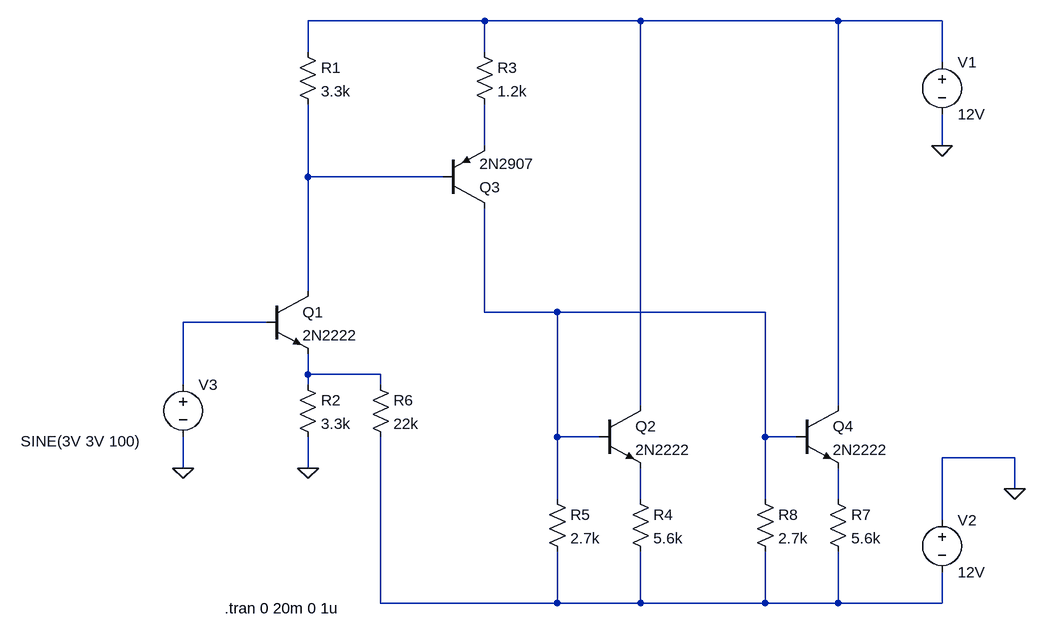
[diagram p0: schematic current_control.asc]
current_control.asc, the LTspice schematic file:
Version 4
SHEET 1 1156 680
WIRE 320 -256 48 -256
WIRE 560 -256 320 -256
WIRE 864 -256 560 -256
WIRE 1024 -256 864 -256
WIRE 48 -208 48 -256
WIRE 320 -208 320 -256
WIRE 1024 -192 1024 -256
WIRE 320 -64 320 -128
WIRE 1024 -64 1024 -112
WIRE 48 -16 48 -128
WIRE 256 -16 48 -16
WIRE 48 160 48 -16
WIRE 320 192 320 32
WIRE 432 192 320 192
WIRE 752 192 432 192
WIRE -16 208 -144 208
WIRE 48 288 48 256
WIRE 160 288 48 288
WIRE -144 304 -144 208
WIRE 48 304 48 288
WIRE 160 304 160 288
WIRE 560 336 560 -256
WIRE 864 336 864 -256
WIRE 432 384 432 192
WIRE 496 384 432 384
WIRE 752 384 752 192
WIRE 800 384 752 384
WIRE 1136 416 1024 416
WIRE -144 432 -144 384
WIRE 48 432 48 384
WIRE 1136 464 1136 416
WIRE 432 480 432 384
WIRE 560 480 560 432
WIRE 752 480 752 384
WIRE 864 480 864 432
WIRE 1024 512 1024 416
WIRE 160 640 160 384
WIRE 432 640 432 560
WIRE 432 640 160 640
WIRE 560 640 560 560
WIRE 560 640 432 640
WIRE 752 640 752 560
WIRE 752 640 560 640
WIRE 864 640 864 560
WIRE 864 640 752 640
WIRE 1024 640 1024 592
WIRE 1024 640 864 640
FLAG 1024 -64 0
FLAG 48 432 0
FLAG 1136 464 0
FLAG -144 432 0
SYMBOL npn2 -16 160 R0
SYMATTR InstName Q1
SYMATTR Value 2N2222
SYMBOL npn2 496 336 R0
SYMATTR InstName Q2
SYMATTR Value 2N2222
SYMBOL pnp2 256 32 M180
SYMATTR InstName Q3
SYMATTR Value 2N2907
SYMBOL voltage 1024 -208 R0
WINDOW 123 0 0 Left 0
WINDOW 39 0 0 Left 0
SYMATTR InstName V1
SYMATTR Value 12V
SYMBOL res 32 288 R0
SYMATTR InstName R2
SYMATTR Value 3.3k
SYMBOL res 304 -224 R0
SYMATTR InstName R3
SYMATTR Value 1.2k
SYMBOL voltage 1024 496 R0
WINDOW 123 0 0 Left 0
WINDOW 39 0 0 Left 0
SYMATTR InstName V2
SYMATTR Value 12V
SYMBOL res 544 464 R0
SYMATTR InstName R4
SYMATTR Value 5.6k
SYMBOL res 416 464 R0
SYMATTR InstName R5
SYMATTR Value 2.7k
SYMBOL voltage -144 288 R0
WINDOW 123 0 0 Left 0
WINDOW 39 0 0 Left 0
WINDOW 3 -250 103 Left 2
SYMATTR Value SINE(3V 3V 100)
SYMATTR InstName V3
SYMBOL res 32 -224 R0
SYMATTR InstName R1
SYMATTR Value 3.3k
SYMBOL res 144 288 R0
SYMATTR InstName R6
SYMATTR Value 22k
SYMBOL npn2 800 336 R0
SYMATTR InstName Q4
SYMATTR Value 2N2222
SYMBOL res 848 464 R0
SYMATTR InstName R7
SYMATTR Value 5.6k
SYMBOL res 736 464 R0
SYMATTR InstName R8
SYMATTR Value 2.7k
TEXT -80 648 Left 2 !.tran 0 20m 0 1u

The netlist it stands for:
* current_control.asc
Q1 N003 N005 N006 0 2N2222
Q2 N001 N004 N007 0 2N2222
Q3 N004 N003 N002 0 2N2907
V1 N001 0 12V
R2 N006 0 3.3k
R3 N001 N002 1.2k
V2 0 N009 12V
R4 N007 N009 5.6k
R5 N004 N009 2.7k
V3 N005 0 SINE(3V 3V 100)
R1 N001 N003 3.3k
R6 N006 N009 22k
Q4 N001 N004 N008 0 2N2222
R7 N008 N009 5.6k
R8 N004 N009 2.7k
.model NPN NPN
.model PNP PNP
.lib standard.bjt
.tran 0 20m 0 1u
.backanno
.end